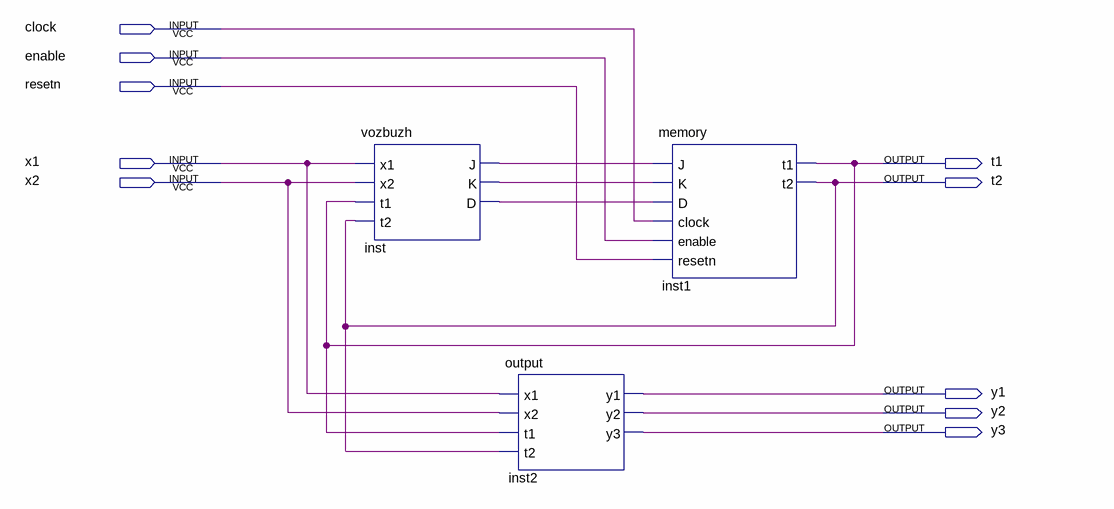
[diagram p0: schematic sheet]
// Quartus schematic mealy_decompose.bdf as structural Verilog: 3 symbols, 10 pins
module mealy_decompose (
  input  clock,
  input  enable,
  input  resetn,
  input  x1,
  input  x2,
  output t1,
  output t2,
  output y1,
  output y2,
  output y3
);

  wire inst_d, inst_j, inst_k;

  vozbuzh inst (.x1(x1), .x2(x2), .t1(t1), .t2(t2), .J(inst_j), .K(inst_k), .D(inst_d));
  \output  inst2 (.x1(x1), .x2(x2), .t1(t1), .t2(t2), .y1(y1), .y2(y2), .y3(y3));
  memory inst1 (.J(inst_j), .K(inst_k), .D(inst_d), .clock(clock), .enable(enable), .resetn(resetn), .t1(t1), .t2(t2));
endmodule
